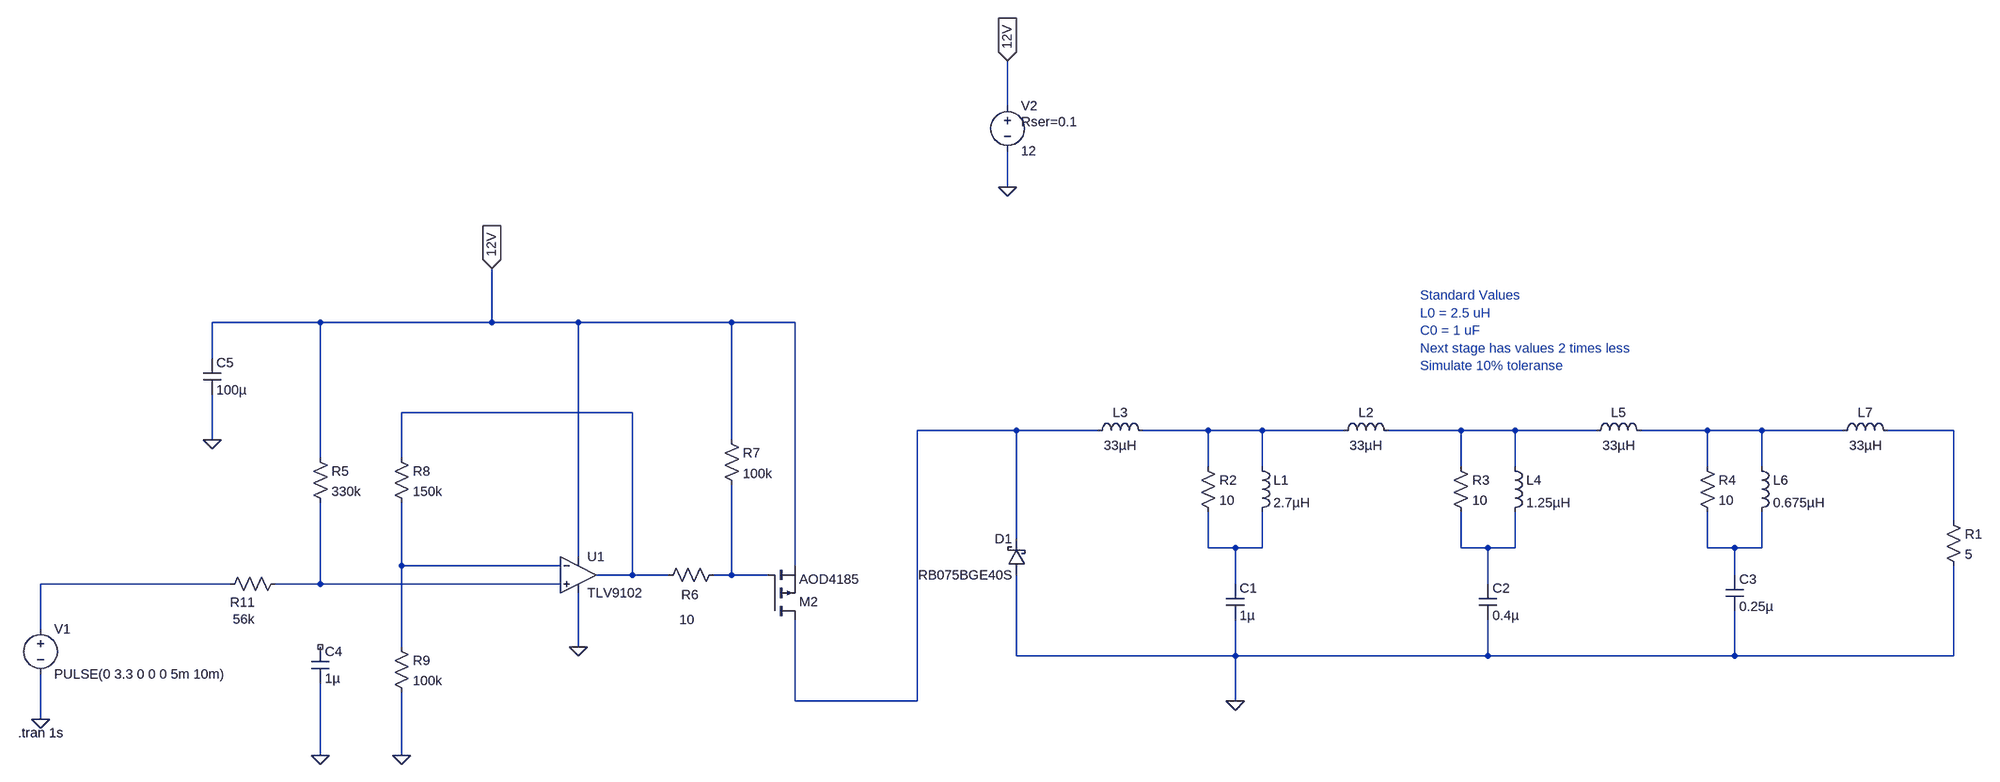
[diagram p0: schematic PWM_concept_07_alt.asc]
PWM_concept_07_alt.asc, the LTspice schematic file:
Version 4
SHEET 1 3368 836
WIRE 48 -560 48 -640
WIRE 48 -416 48 -480
WIRE -1232 -176 -1424 -176
WIRE -928 -176 -928 -272
WIRE -928 -176 -1232 -176
WIRE -768 -176 -928 -176
WIRE -496 -176 -768 -176
WIRE -384 -176 -496 -176
WIRE -1424 -112 -1424 -176
WIRE -672 -16 -1088 -16
WIRE 64 16 -112 16
WIRE 208 16 64 16
WIRE 432 16 288 16
WIRE 528 16 432 16
WIRE 672 16 528 16
WIRE 880 16 752 16
WIRE 976 16 880 16
WIRE 1120 16 976 16
WIRE 1344 16 1200 16
WIRE 1440 16 1344 16
WIRE 1584 16 1440 16
WIRE 1792 16 1664 16
WIRE -1424 32 -1424 -48
WIRE -496 32 -496 -176
WIRE -1232 64 -1232 -176
WIRE -1088 64 -1088 -16
WIRE 432 80 432 16
WIRE 528 80 528 16
WIRE 880 80 880 16
WIRE 976 80 976 16
WIRE 1344 80 1344 16
WIRE 1440 80 1440 16
WIRE 1792 176 1792 16
WIRE 64 208 64 16
WIRE 432 224 432 160
WIRE 480 224 432 224
WIRE 528 224 528 160
WIRE 528 224 480 224
WIRE 880 224 880 160
WIRE 928 224 880 224
WIRE 976 224 976 160
WIRE 976 224 928 224
WIRE 1344 224 1344 160
WIRE 1392 224 1344 224
WIRE 1440 224 1440 160
WIRE 1440 224 1392 224
WIRE -768 240 -768 -176
WIRE -1088 256 -1088 144
WIRE -800 256 -1088 256
WIRE -384 256 -384 -176
WIRE -672 272 -672 -16
WIRE -672 272 -736 272
WIRE -608 272 -672 272
WIRE -496 272 -496 112
WIRE -496 272 -528 272
WIRE -432 272 -496 272
WIRE 1392 272 1392 224
WIRE -1392 288 -1728 288
WIRE -1232 288 -1232 144
WIRE -1232 288 -1312 288
WIRE -800 288 -1232 288
WIRE 480 288 480 224
WIRE 928 288 928 224
WIRE -1728 368 -1728 288
WIRE -1088 400 -1088 256
WIRE -768 400 -768 304
WIRE 64 416 64 272
WIRE 480 416 480 352
WIRE 480 416 64 416
WIRE 928 416 928 352
WIRE 928 416 480 416
WIRE 1392 416 1392 336
WIRE 1392 416 928 416
WIRE 1792 416 1792 256
WIRE 1792 416 1392 416
WIRE -384 496 -384 352
WIRE -112 496 -112 16
WIRE -112 496 -384 496
WIRE 480 496 480 416
WIRE -1728 528 -1728 448
WIRE -1232 592 -1232 464
WIRE -1088 592 -1088 480
FLAG -1728 528 0
FLAG 48 -416 0
FLAG -928 -272 12V
IOPIN -928 -272 In
FLAG 48 -640 12V
IOPIN 48 -640 In
FLAG -1088 592 0
FLAG 480 496 0
FLAG -768 400 0
FLAG -1232 592 0
FLAG -1424 32 0
SYMBOL voltage -1728 352 R0
WINDOW 123 0 0 Left 0
WINDOW 39 0 0 Left 0
SYMATTR InstName V1
SYMATTR Value PULSE(0 3.3 0 0 0 5m 10m)
SYMBOL res 1776 160 R0
SYMATTR InstName R1
SYMATTR Value 5
SYMBOL cap 464 288 R0
SYMATTR InstName C1
SYMATTR Value 1µ
SYMBOL ind 512 64 R0
SYMATTR InstName L1
SYMATTR Value 2.7µH
SYMBOL ind 656 32 R270
WINDOW 0 32 56 VTop 2
WINDOW 3 5 56 VBottom 2
SYMATTR InstName L2
SYMATTR Value 33µH
SYMBOL ind 192 32 R270
WINDOW 0 32 56 VTop 2
WINDOW 3 5 56 VBottom 2
SYMATTR InstName L3
SYMATTR Value 33µH
SYMBOL cap 912 288 R0
SYMATTR InstName C2
SYMATTR Value 0.4µ
SYMBOL ind 960 64 R0
SYMATTR InstName L4
SYMATTR Value 1.25µH
SYMBOL ind 1104 32 R270
WINDOW 0 32 56 VTop 2
WINDOW 3 5 56 VBottom 2
SYMATTR InstName L5
SYMATTR Value 33µH
SYMBOL cap 1376 272 R0
SYMATTR InstName C3
SYMATTR Value 0.25µ
SYMBOL ind 1424 64 R0
SYMATTR InstName L6
SYMATTR Value 0.675µH
SYMBOL ind 1568 32 R270
WINDOW 0 32 56 VTop 2
WINDOW 3 5 56 VBottom 2
SYMATTR InstName L7
SYMATTR Value 33µH
SYMBOL res 416 64 R0
SYMATTR InstName R2
SYMATTR Value 10
SYMBOL res 864 64 R0
SYMATTR InstName R3
SYMATTR Value 10
SYMBOL res 1328 64 R0
SYMATTR InstName R4
SYMATTR Value 10
SYMBOL voltage 48 -576 R0
WINDOW 123 0 0 Left 0
WINDOW 39 24 44 Left 2
SYMATTR SpiceLine Rser=0.1
SYMATTR InstName V2
SYMATTR Value 12
SYMBOL schottky 80 272 R180
WINDOW 0 24 64 Left 2
WINDOW 3 24 0 Left 2
SYMATTR InstName D1
SYMATTR Value RB075BGE40S
SYMATTR Description Diode
SYMATTR Type diode
SYMBOL res -1296 272 R90
WINDOW 0 64 74 VBottom 2
WINDOW 3 63 72 VTop 2
SYMATTR InstName R11
SYMATTR Value 56k
SYMBOL pmos -432 352 M180
SYMATTR InstName M2
SYMATTR Value AOD4185
SYMBOL res -512 256 R90
WINDOW 0 67 58 VBottom 2
WINDOW 3 80 63 VTop 2
SYMATTR InstName R6
SYMATTR Value 10
SYMBOL Custom\\TLV9102 -768 208 R0
SYMATTR InstName U1
SYMBOL res -1104 48 R0
SYMATTR InstName R8
SYMATTR Value 150k
SYMBOL res -1104 384 R0
SYMATTR InstName R9
SYMATTR Value 100k
SYMBOL res -1248 48 R0
SYMATTR InstName R5
SYMATTR Value 330k
SYMBOL cap -1248 400 R0
SYMATTR InstName C4
SYMATTR Value 1µ
SYMBOL cap -1440 -112 R0
SYMATTR InstName C5
SYMATTR Value 100µ
SYMBOL res -512 16 R0
SYMATTR InstName R7
SYMATTR Value 100k
TEXT -1768 552 Left 2 !.tran 1s
TEXT 808 -224 Left 2 ;Standard Values\nL0 = 2.5 uH\nC0 = 1 uF\nNext stage has values 2 times less\nSimulate 10% toleranse

The netlist it stands for:
* PWM_concept_07_alt.asc
V1 N012 0 PULSE(0 3.3 0 0 0 5m 10m)
R1 N006 0 5
C1 N007 0 1µ
L1 N003 N007 2.7µH
L2 N003 N004 33µH
L3 N002 N003 33µH
C2 N008 0 0.4µ
L4 N004 N008 1.25µH
L5 N004 N005 33µH
C3 N009 0 0.25µ
L6 N005 N009 0.675µH
L7 N005 N006 33µH
R2 N003 N007 10
R3 N004 N008 10
R4 N005 N009 10
V2 12V 0 12 Rser=0.1
D1 0 N002 RB075BGE40S
R11 N013 N012 56k
M2 N002 N011 12V 12V AOD4185
R6 N011 N001 10
* U1: TLV9102 (symbol Custom\TLV9102 not available, pins judged from their places): In+=N013 In-=N010 V+=12V V-=0 OUT=N001
R8 N001 N010 150k
R9 N010 0 100k
R5 12V N013 330k
C4 NC_01 0 1µ
C5 12V 0 100µ
R7 12V N011 100k
.model D D
.lib standard.dio
.model NMOS NMOS
.model PMOS PMOS
.lib standard.mos
.tran 1s
* Standard Values
* L0 = 2.5 uH
* C0 = 1 uF
* Next stage has values 2 times less
* Simulate 10% toleranse
.backanno
.end